# Altium schematic sheet PSU.SchDoc
size A; SheetNumber: 2; SheetTotal: 10
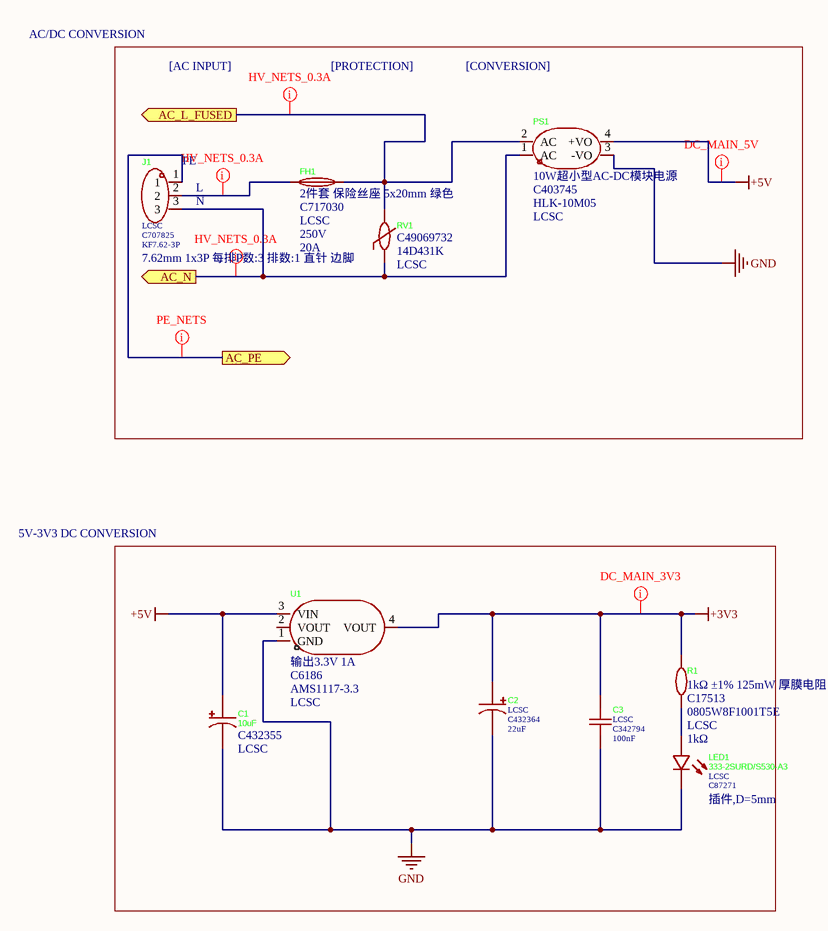
[diagram p0: PSU.SchDoc]

## Parts
C1  10uF  Supplier Part: C432355  Supplier: LCSC  [CAP-TH_BD5.0-P2.00-D0.8-FD]
C2  Supplier: LCSC  Supplier Part: C432364  [CAP-TH_BD5.0-P2.00-D0.5-FD-1]  (hidden comment: 22uF)
C3  Supplier: LCSC  Supplier Part: C342794  [CAP-TH_L4.0-W2.5-P5.00-D1.0]  (hidden comment: 100nF)
FH1  LCSC Part Name: 2件套 保险丝座 5x20mm 绿色  Supplier Part: C717030  Supplier: LCSC  Voltage Rating: 250V  Current Rating: 20A  [FUSE-TH_L24.4-W9.4-P22.60]  (hidden comment: PTF-77)
J1  Supplier: LCSC  Supplier Part: C707825  LCSC Part Name: 7.62mm 1x3P 每排P数:3 排数:1 直针 边脚  [CONN-TH_KF7.62-3P]  (hidden comment: KF7.62-3P)
LED1  333-2SURD/S530-A3  Supplier: LCSC  Supplier Part: C87271  Supplier Footprint: 插件,D=5mm  [LED-TH_BD5.9-P2.54-RD_RED]
PS1  LCSC Part Name: 10W超小型AC-DC模块电源  Supplier Part: C403745  Supplier: LCSC  [PWRM-TH_HLK-10M05]  (hidden comment: HLK-10M05)
R1  LCSC Part Name: 1kΩ ±1% 125mW 厚膜电阻  Supplier Part: C17513  Supplier: LCSC  [R0805]  (hidden comment: 1kΩ)
RV1  Supplier Part: C49069732  Manufacturer Part: 14D431K  Supplier: LCSC  [RES-TH_L14.5-W6.0-P7.50-D0.8-S6.0]  (hidden comment: 440pF)
U1  LCSC Part Name: 输出3.3V 1A  Supplier Part: C6186  Supplier: LCSC  [SOT-223-3_L6.5-W3.4-P2.30-LS7.0-BR]  (hidden comment: AMS1117-3.3)

## Ports
AC_L_FUSED (out), AC_N (out), AC_PE (out)

## Nets
+3V3: C2.1 C3.1 R1.2 U1.4(VOUT)
+5V: C1.1 PS1.4(+VO) U1.3(VIN)
GND: C1.2 C2.2 C3.2 LED1.1(C) PS1.3(-VO) U1.1(GND)
AC_L_FUSED: FH1.2 PS1.2(AC) RV1.2 ; port AC_L_FUSED
AC_N: J1.3 PS1.1(AC) RV1.1 ; port AC_N
AC_PE: J1.1 ; port AC_PE
NetFH1_1: FH1.1 J1.2
NetLED1_2: LED1.2(A) R1.1

Not connected (* = marked no-connect by the designer): U1 2(VOUT)

## Layout directives
net class HV_NETS_0.3A: AC_L_FUSED, AC_N, NetFH1_1
net class PE_NETS: AC_PE
net class DC_MAIN_5V: +5V
net class DC_MAIN_3V3: +3V3

## Notes on the sheet
- AC/DC CONVERSION
- [AC INPUT]
- [PROTECTION]
- [CONVERSION]
- (near J1) PE
- (near J1) L
- (near J1) N
- 5V-3V3 DC CONVERSION

## Library data of the parts
C1 = 50YXJ10M5X11: Manufacturer: Rubycon(红宝石); Add into BOM: yes; Tolerance: ±20%; Voltage Rating: 50V; Pin Spacing: 2mm; Lifetime: 5000hrs@105℃; Symbol: 50YXJ10M5X11; Device: 50YXJ10M5X11; Value: 10uF; LCSC Part Name: 10uF ±20% 50V; Manufacturer Part: 50YXJ10M5X11; Supplier Footprint: 插件,D5xL11mm; JLCPCB Part Class: Extended Part; Datasheet: https://item.szlcsc.com/datasheet/50YXJ10M5X11/429163.html; Convert to PCB: yes; Diameter: 5mm; Height - Seated (Max): 11mm
C2 = 50YXJ22M5X11: Manufacturer: rubycon(红宝石); Add into BOM: yes; Tolerance: ±20%; Symbol: 50YXJ22M5X11; Device: 50YXJ22M5X11; Manufacturer Part: 50YXJ22M5X11; LCSC Part Name: 22uF ±20% 50V; Supplier Footprint: 插件,D5xL11mm; JLCPCB Part Class: Extended Part; Datasheet: https://atta.szlcsc.com/upload/public/pdf/source/20190927/C432444_D90212164DBC1B856ABE912664018FD4.pdf; Convert to PCB: yes; Ripple Current: -; Equivalent Series Resistance(ESR): -; Lead Spacing: 2mm; Lifetime @ Temp: -; Value: 22uF
C3 = FG28X7R1H104KNT06: Manufacturer: TDK; Add into BOM: yes; Tolerance: ±10%; Voltage Rating: 50V; Temperature Coefficient: X7R; Pin Spacing: 5mm; Symbol: FG28X7R1H104KNT06; Device: FG28X7R1H104KNT06; LCSC Part Name: 100nF ±10% 50V; Manufacturer Part: FG28X7R1H104KNT06; Supplier Footprint: 插件,P=5mm; JLCPCB Part Class: Extended Part; Datasheet: https://item.szlcsc.com/datasheet/FG28X7R1H104KNT06/319644.html; Convert to PCB: yes; Value: 100nF
FH1 = PTF-77: Manufacturer: XFCN(兴飞); Add into BOM: yes; Fuseholder Type: Bracket type; Number of Circuits: 1; Fuse Type: Cylindrical; Fuse Diameter (φD): 5mm; Fuse Length: 20mm; Symbol: PTF-77; Device: PTF-77; Manufacturer Part: PTF-77; Supplier Footprint: 插件,P=22.5mm; JLCPCB Part Class: Extended Part; Datasheet: https://item.szlcsc.com/datasheet/PTF-77/757629.html; Convert to PCB: yes
J1 = KF7.62-3P: Manufacturer: KEFA(科发); Barrier Type: 2-Side; Pitch: 7.62mm; Add into BOM: yes; Number of Positions or Pins: 1x3P; Pin Location: Side Mount; Number of PINs Per Row: 3; Current Rating: 24A; Voltage Rating (Max): 450V; Wire Gauge - AWG: 12~22; Wire Gauge - mm2: 2.5; Symbol: KF7.62-3P; Device: KF7.62-3P; JLCPCB Part Class: Extended Part; Supplier Footprint: 插件,P=7.62mm; Datasheet: https://item.szlcsc.com/datasheet/KF7.62-3P/745034.html; Convert to PCB: yes; Mounting Type: Straight Pin; Number of Pins: 3P; Number of Rows: 1; Operating Temperature: -40℃~+105℃; Color: Black; Manufacturer Part: KF7.62-3P
LED1 = 333-2SURD/S530-A3: Manufacturer: EVERLIGHT(亿光); Lamp Holder Type: 5 mm round LED; Add into BOM: yes; Illumination Color: Red; Voltage - Forward(Vf): 2V; Forward Current: 20mA; Wavelength - Dominant: 624nm; Peak Wavelength: 632nm; Lens Color: Red Lens; Luminous Intensity: 200mcd; Viewing Angle: 30°; Symbol: 333-2SURD/S530-A3; Device: 333-2SURD/S530-A3; Manufacturer Part: 333-2SURD/S530-A3; LCSC Part Name: 5mm圆形灯头 红色; JLCPCB Part Class: Extended Part; Datasheet: https://en.everlight.com/wp-content/plugins/ItemRelationship/product_files/pdf/333-2SURD-S530-A3.pdf; Convert to PCB: yes
PS1 = HLK-10M05: Manufacturer: HI-LINK(海凌科); Add into BOM: yes; Symbol: HLK-10M05; Device: HLK-10M05; Supplier Footprint: DIP,46.9x27.8mm; JLCPCB Part Class: Extended Part; Datasheet: https://item.szlcsc.com/datasheet/HLK-10M05/389994.html; Convert to PCB: yes; Manufacturer Part: HLK-10M05
R1 = 0805W8F1001T5E: Manufacturer: UNI-ROYAL(厚声); Add into BOM: yes; Tolerance: ±1%; Temperature Coefficient: ±100ppm/℃; Symbol: 0805W8F1001T5E; Device: 0805W8F1001T5E; Supplier Footprint: 0805; JLCPCB Part Class: Basic Part; Datasheet: https://atta.szlcsc.com/upload/public/pdf/source/20200306/C422600_1E6D84923E4A46A82E41ADD87F860B5C.pdf; Convert to PCB: yes; Type: Thick Film Resistors; Operating Temperature Range: -55℃~+155℃; Manufacturer Part: 0805W8F1001T5E; Value: 1kΩ
RV1 = 14D431K_C49069732: Manufacturer: R+O(宏嘉诚); Add into BOM: yes; Varistor Voltage: 387V~473V; Clamping Voltage: 710V; Maximum DC Volts: 350V; Maximum AC Volts: 275V; Peak Current: 4.5kA; Energy: 136J; Rated Wattage: 600mW; Symbol: 14D431K_C49069732; Device: 14D431K_C49069732; LCSC Part Name: 710V 136J; Supplier Footprint: 插件,P=7.5mm; JLCPCB Part Class: Extended Part; Datasheet: https://item.szlcsc.com/datasheet/14D431K/51445298.html; Convert to PCB: yes; Value: 440pF
U1 = AMS1117-3.3_C6186: Manufacturer: AMS; Add into BOM: yes; Output Type: Fixed; Voltage - Supply: 16V; Output Voltage: 3.3V; Output Current: 1A; Power Supply Rejection Ratio (PSRR): 72dB@(120Hz); Voltage Dropout: 1.1V@(800mA); standby current: 5mA; Noise: 0.003%Vout; Output Configuration: Positive; Number of Outputs: 1; Symbol: AMS1117-3.3; Device: AMS1117-3.3_C6186; Supplier Footprint: SOT-223; JLCPCB Part Class: Basic Part; Datasheet: https://item.szlcsc.com/datasheet/AMS1117-3.3/6652.html; Convert to PCB: yes; Features: Over Current Protection；Over Temperature Protection; Operating Temperature: -40℃~+125℃; Manufacturer Part: AMS1117-3.3